# EAGLE design MB-Peripheral-1 (EAGLE 5.10)
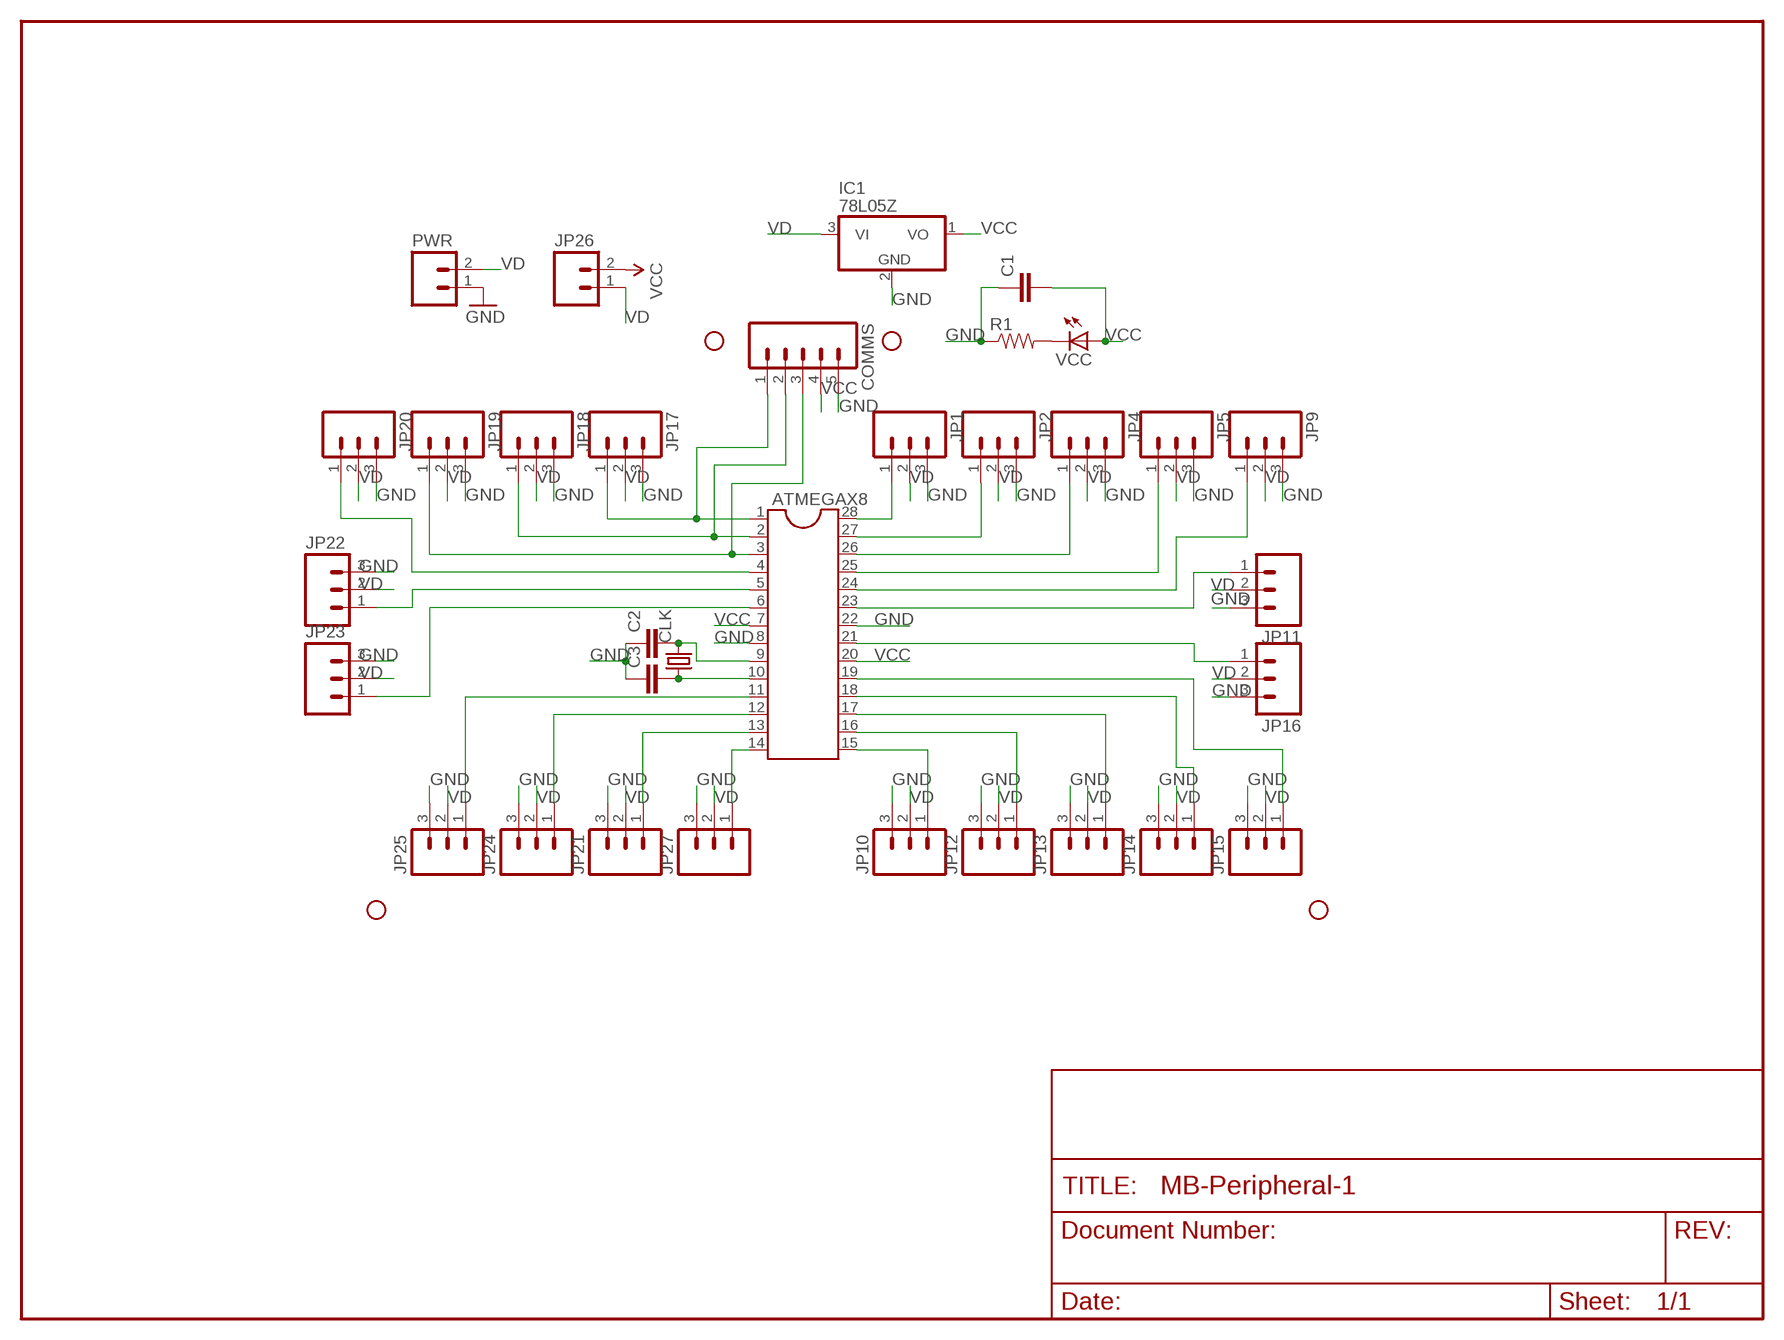
[diagram p0: schematic, sheet 1]

## Parts
ATMEGAX8  DIL28-3  [DIL28-3]
C1  CAPPTH1  [CAP-PTH-5MM]
C2  CAPPTH  [CAP-PTH-SMALL]
C3  CAPPTH  [CAP-PTH-SMALL]
CLK  CRYSTALHC49S  [HC49/S]
COMMS  M05LOCK  [1X05_LOCK]
IC1  78L05Z  [TO92]
JP1  M03LOCK  [1X03_LOCK]
JP2  M03LOCK  [1X03_LOCK]
JP3  STAND-OFF  [STAND-OFF]
JP4  M03LOCK  [1X03_LOCK]
JP5  M03LOCK  [1X03_LOCK]
JP7  STAND-OFF  [STAND-OFF]
JP9  M03LOCK  [1X03_LOCK]
JP10  M03LOCK  [1X03_LOCK]
JP11  M03LOCK  [1X03_LOCK]
JP12  M03LOCK  [1X03_LOCK]
JP13  M03LOCK  [1X03_LOCK]
JP14  M03LOCK  [1X03_LOCK]
JP15  M03LOCK  [1X03_LOCK]
JP16  M03LOCK  [1X03_LOCK]
JP17  M03LOCK  [1X03_LOCK]
JP18  M03LOCK  [1X03_LOCK]
JP19  M03LOCK  [1X03_LOCK]
JP20  M03LOCK  [1X03_LOCK]
JP21  M03LOCK  [1X03_LOCK]
JP22  M03LOCK  [1X03_LOCK]
JP23  M03LOCK  [1X03_LOCK]
JP24  M03LOCK  [1X03_LOCK]
JP25  M03LOCK  [1X03_LOCK]
JP26  M02LOCK  [1X02_LOCK]
JP27  M03LOCK  [1X03_LOCK]
JP29  STAND-OFF  [STAND-OFF]
JP30  STAND-OFF  [STAND-OFF]
PWR  M023.5MM_LOCK  [SCREWTERMINAL-3.5MM-2_LOCK]
R1  RESISTORPTH1  [AXIAL-0.3]
VCC  LED3MM  [LED3MM]

## Nets
GND: ATMEGAX8.8 ATMEGAX8.22 C1.1 C2.1 C3.1 COMMS.5 IC1.2(GND) JP1.3 JP2.3 JP4.3 JP5.3 JP9.3 JP10.3 JP11.3 JP12.3 JP13.3 JP14.3 JP15.3 JP16.3 JP17.3 JP18.3 JP19.3 JP20.3 JP21.3 JP22.3 JP23.3 JP24.3 JP25.3 JP27.3 PWR.1 R1.P$1
N$1: ATMEGAX8.9 C2.2 CLK.2
N$2: ATMEGAX8.5 JP22.1
N$3: ATMEGAX8.16 JP12.1
N$4: ATMEGAX8.15 JP10.1
N$5: ATMEGAX8.21 JP16.1
N$6: ATMEGAX8.19 JP15.1
N$7: R1.P$2 VCC.K(C)
N$8: ATMEGAX8.17 JP13.1
N$9: ATMEGAX8.23 JP11.1
N$10: ATMEGAX8.24 JP9.1
N$11: ATMEGAX8.25 JP5.1
N$12: ATMEGAX8.26 JP4.1
N$14: ATMEGAX8.14 JP27.1
N$16: ATMEGAX8.10 C3.2 CLK.1
N$17: ATMEGAX8.27 JP2.1
N$18: ATMEGAX8.28 JP1.1
N$19: ATMEGAX8.4 JP20.1
N$20: ATMEGAX8.13 JP21.1
N$21: ATMEGAX8.12 JP24.1
N$25: ATMEGAX8.6 JP23.1
N$26: ATMEGAX8.11 JP25.1
N$35: ATMEGAX8.18 JP14.1
RST: ATMEGAX8.1 COMMS.1 JP17.1
RXD: ATMEGAX8.2 COMMS.2 JP18.1
TXD: ATMEGAX8.3 COMMS.3 JP19.1
VCC: ATMEGAX8.7 ATMEGAX8.20 C1.2 COMMS.4 IC1.1(VO) JP26.2 VCC.A
VD: IC1.3(VI) JP1.2 JP2.2 JP4.2 JP5.2 JP9.2 JP10.2 JP11.2 JP12.2 JP13.2 JP14.2 JP15.2 JP16.2 JP17.2 JP18.2 JP19.2 JP20.2 JP21.2 JP22.2 JP23.2 JP24.2 JP25.2 JP26.1 JP27.2 PWR.2

## Library data of the parts
ATMEGAX8 = ic-package:DIL28: Dual In Line
C1-C3 = SparkFun:CAP: Capacitor Standard 0603 ceramic capacitor, and 0.1" leaded capacitor.
CLK = crystal:CRYSTAL: CRYSTAL
COMMS = SparkFun:M05: Header 5 Standard 5-pin 0.1" header. Use with straight break away headers (SKU : PRT-00116), right angle break away headers (PRT-00553), swiss pins (PRT-00743), machine pins (PRT-00117), and female headers (PRT-00115). Molex polarized connector foot print use with SKU : PRT-08230 with associated crimp pins and housings.
IC1 = linear:78*: Positive VOLTAGE REGULATOR Source: http://cache.national.com/ds/LM/LM78L05.pdf http://www.fairchildsemi.com/ds/LM/LM7805.pdf
JP1 JP2 JP4 JP5 JP9-JP25 JP27 = SparkFun:M03: Header 3 Standard 3-pin 0.1" header. Use with straight break away headers (SKU : PRT-00116), right angle break away headers (PRT-00553), swiss pins (PRT-00743), machine pins (PRT-00117), and female headers (PRT-00115). Molex polarized connector foot print use with SKU : PRT-08232 with associated crimp pins and housings.
JP3 JP7 JP29 JP30 = SparkFun:STAND-OFF: Stand Off This is the mechanical footprint for a #4 phillips button head screw. Use the keepout ring to avoid running the screw head into surrounding components. SKU : PRT-00447
JP26 PWR = SparkFun:M02: Header 2 Standard 2-pin 0.1" header. Use with straight break away headers (SKU : PRT-00116), right angle break away headers (PRT-00553), swiss pins (PRT-00743), machine pins (PRT-00117), and female headers (PRT-00115). Molex polarized connector foot print use with SKU : PRT-08233 with associated crimp pins and housings.
R1 = SparkFun:RESISTOR: Resistor Basic schematic elements and footprints for 0603, 1206, and PTH 1/10th watt (small) resistors.
VCC = SparkFun:LED: LEDs Standard schematic elements and footprints for 5mm, 3mm, 1206, and 0603 sized LEDs. 5mm - Spark Fun Electronics SKU : COM-00529 (and others)

## Board
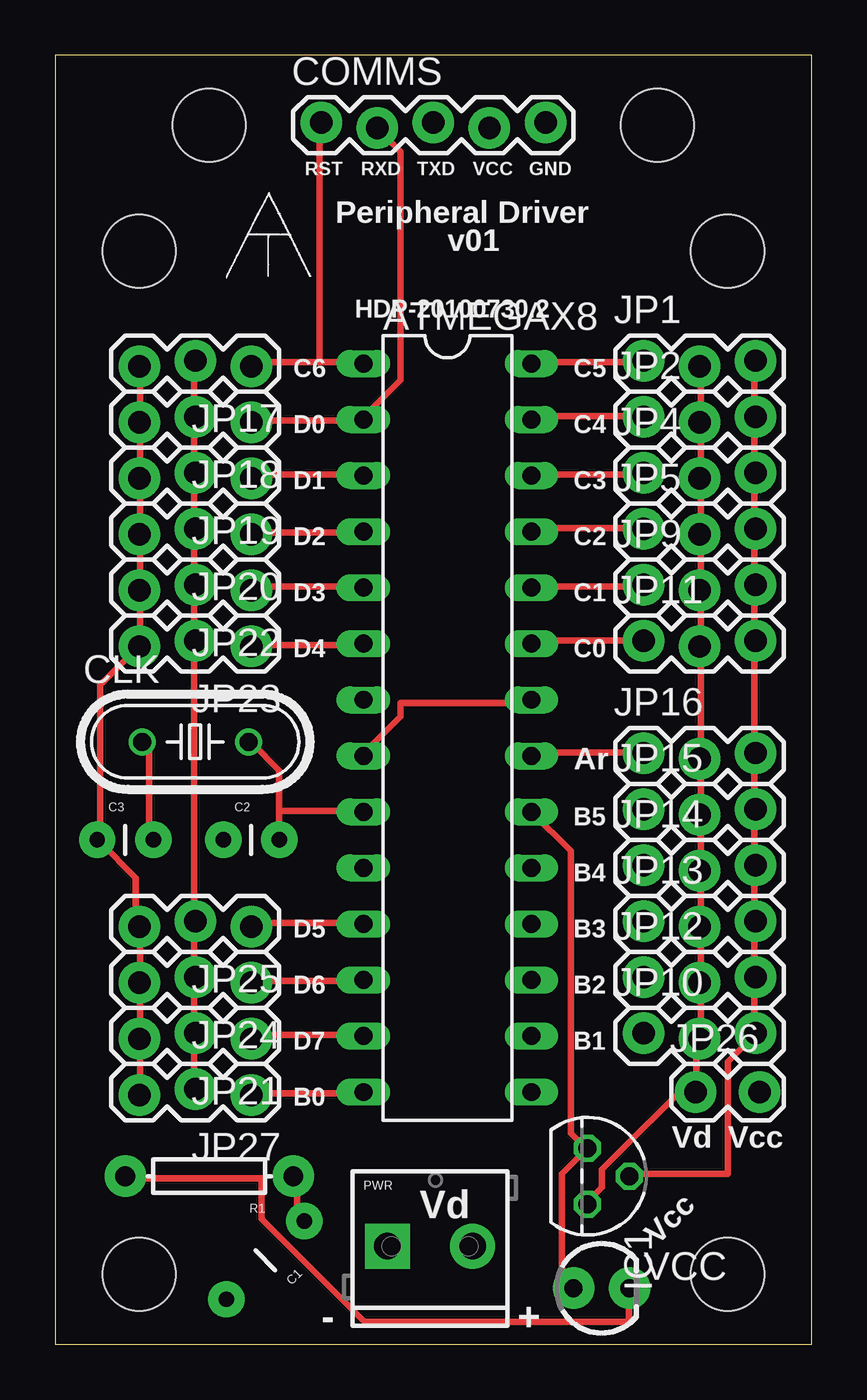
[diagram p1: board, top side]
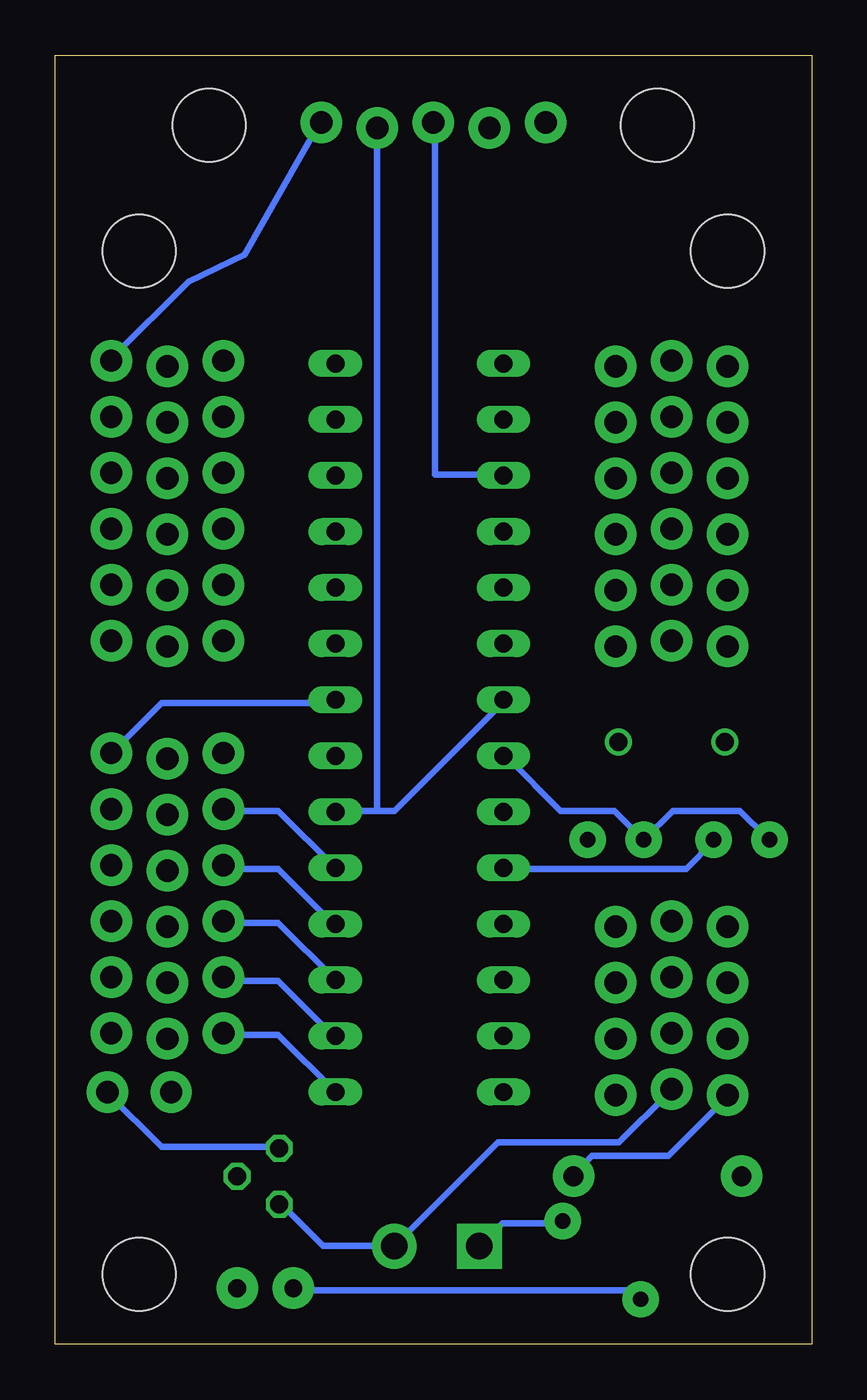
[diagram p2: board, bottom side, seen from below]

Size 34.29 x 58.42 mm. Coordinates in mm from the lower left corner, seen from the top.
Outline: 0,0 34.29,0 34.29,58.42 0,58.42 0,0
Copper layers (1*16): Top 0.0356mm / dielectric 1.5011mm / Bottom 0.0356mm
Design rules "LaenPCBOrder *": minimum track width 12mil, minimum drill 13mil, track to track 12mil, track to pad 12mil, pad to pad 12mil, via to via 12mil, smd to smd 6mil, copper to edge 15mil, drill to drill 6mil, minimum pad ring 7mil, minimum via ring 7mil, stop-mask expansion 4mil, vias tented up to drill 0mil, thermal gap 10mil

### Footprints (pad centres in the part's own frame; a part is rotated, then mirrored left to right if it is on the bottom)
DIL28-3 = drill 0.813 long: 1 -16.51,-3.81; 2 -13.97,-3.81; 3 -11.43,-3.81; 4 -8.89,-3.81; 5 -6.35,-3.81; 6 -3.81,-3.81; 7 -1.27,-3.81; 8 1.27,-3.81; 9 3.81,-3.81; 10 6.35,-3.81; 11 8.89,-3.81; 12 11.43,-3.81; 13 13.97,-3.81; 14 16.51,-3.81; 15 16.51,3.81; 16 13.97,3.81; 17 11.43,3.81; 18 8.89,3.81; 19 6.35,3.81; 20 3.81,3.81; 21 1.27,3.81; 22 -1.27,3.81; 23 -3.81,3.81; 24 -6.35,3.81; 25 -8.89,3.81; 26 -11.43,3.81; 27 -13.97,3.81; 28 -16.51,3.81
CAP-PTH-5MM = drill 0.7 pad 1.651 round: 1 -2.5,0; 2 2.5,0
CAP-PTH-SMALL = drill 0.7 pad 1.651 round: 1 0,0; 2 2.54,0
HC49/S = drill 0.813 round: 1 -2.413,0; 2 2.413,0
1X05_LOCK = drill 1.016 pad 1.88 round: 1 0,0.127; 2 2.54,-0.127; 3 5.08,0.127; 4 7.62,-0.127; 5 10.16,0.127
TO92 = drill 0.813 octagon: 1 -1.27,0; 2 0,1.905; 3 1.27,0
1X03_LOCK = drill 1.016 pad 1.88 round: 1 0,0.127; 2 2.54,-0.127; 3 5.08,0.127
STAND-OFF = hole 3.302: 0,0
1X02_LOCK = drill 1.016 pad 1.88 round: 1 -0.178,0; 2 2.718,0
SCREWTERMINAL-3.5MM-2_LOCK = drill 1.2 pad 2.032 square: 1 -0.178,0 | drill 1.2 pad 2.032 round: 2 3.678,0
AXIAL-0.3 = drill 0.9 pad 1.88 round: P$1 -3.81,0; P$2 3.81,0
LED3MM = drill 0.813 pad 1.88 round: A -1.27,0; K 1.27,0

### Placement (x,y rotation side)
ATMEGAX8  17.78,27.94 270 top
C1  9.53,3.81 225 top
C2  7.62,22.86 0 top
C3  1.91,22.86 0 top
CLK  6.35,27.3 0 top
COMMS  12.06,55.24 0 top
IC1  24.13,7.62 270 top
JP1  26.67,44.45 0 top
JP2  26.67,41.91 0 top
JP3  3.81,49.53 0 top
JP4  26.67,39.37 0 top
JP5  26.67,36.83 0 top
JP6  STAND-OFF  [STAND-OFF]  3.81,3.17 0 top
JP7  30.48,3.17 0 top
JP8  STAND-OFF  [STAND-OFF]  30.48,49.53 0 top
JP9  26.67,34.29 0 top
JP10  26.67,13.97 0 top
JP11  26.67,31.75 0 top
JP12  26.67,16.51 0 top
JP13  26.67,19.05 0 top
JP14  26.67,21.59 0 top
JP15  26.67,24.13 0 top
JP16  26.67,26.67 0 top
JP17  8.89,44.45 180 top
JP18  8.89,41.91 180 top
JP19  8.89,39.37 180 top
JP20  8.89,36.83 180 top
JP21  8.89,13.97 180 top
JP22  8.89,34.29 180 top
JP23  8.89,31.75 180 top
JP24  8.89,16.51 180 top
JP25  8.89,19.05 180 top
JP26  29.21,11.43 0 top
JP27  8.89,11.43 180 top
JP29  27.3,55.24 0 top
JP30  6.99,55.24 0 top
PWR  15.24,4.45 0 top
R1  6.99,7.62 180 top
VCC  24.77,2.54 0 top

### Tracks (layer width: path | path; a pad name or v marks a point on that pad's centre or on a via)
GND
  Top 0.305: IC1.2 26.21,7.72 30.48,7.72 30.48,12.8 31.7,14.02 JP10.3 31.7,14.22 31.7,16.46 JP12.3 31.7,16.66 31.7,19.1 JP13.3 31.7,19.3 31.7,21.54 JP14.3 31.7,21.74 31.7,24.18 JP15.3 31.7,24.38 31.7,26.62 JP16.3 31.7,26.82 31.7,31.7 JP11.3 31.7,31.9 31.7,34.34 JP9.3 31.7,34.54 31.7,36.78 JP5.3 31.7,36.98 31.7,39.42 JP4.3 31.7,39.62 31.7,41.86 JP2.3 31.7,42.06 31.7,44.5 JP1.3 | ATMEGAX8.22 21.54,29.06 15.65,29.06 15.65,28.45 14.02,26.82 ATMEGAX8.8 | JP17.3 3.86,44.3 3.86,41.86 JP18.3 3.86,41.66 3.86,39.42 JP19.3 3.86,39.22 3.86,36.78 JP20.3 3.86,36.58 3.86,34.34 JP22.3 3.86,34.14 3.86,31.7 JP23.3 3.66,31.5 2.03,29.87 2.03,22.96 C3.1 2.03,22.76 3.66,21.13 3.66,19.1 JP25.3 3.86,18.9 3.86,16.46 JP24.3 3.86,16.26 3.86,14.02 JP21.3 3.86,13.82 3.86,11.38 JP27.3 | C1.1 11.18,5.69 10.97,5.89 10.97,7.52 R1.P$1
  Bottom 0.305: COMMS.5 22.35,55.27 25.7,49.38 28.25,48.16 31.7,44.7 JP1.3 | ATMEGAX8.8 13.82,26.62 11.38,24.18 8.94,24.18 C2.1 6.3,24.18 3.25,24.18 2.03,22.96 C3.1 | PWR.1 14.02,5.49 11.38,5.49 C1.1 | R1.P$1 10.77,7.72 9.96,8.53 6.5,8.53 3.86,11.18 JP27.3 | JP16.3 31.7,26.82 29.46,29.06 21.74,29.06 ATMEGAX8.22
N$1
  Top 0.305: 10.16,24.18 10.16,26.01 8.94,27.23 CLK.2 | C2.2 10.16,24.18 | 10.16,24.18 13.82,24.18 ATMEGAX8.9
N$2
  Top 0.305: ATMEGAX8.5 13.82,34.34 8.94,34.34 JP22.1
N$3
  Bottom 0.305: ATMEGAX8.16 21.74,14.02 24.18,16.46 26.62,16.46 JP12.1
N$4
  Bottom 0.305: ATMEGAX8.15 24.18,14.02 26.62,14.02 JP10.1
N$5
  Top 0.305: ATMEGAX8.21 21.74,26.82 26.62,26.82 JP16.1
N$6
  Bottom 0.305: ATMEGAX8.19 24.18,24.18 26.62,24.18 JP15.1
N$7
  Top 0.305: R1.P$2 3.25,7.52 9.35,7.52 9.35,5.69 14.02,1.02 26.01,1.02 26.01,2.44 VCC.K
N$8
  Bottom 0.305: ATMEGAX8.17 24.18,19.1 26.62,19.1 JP13.1
N$9
  Top 0.305: ATMEGAX8.23 21.74,31.9 26.62,31.9 JP11.1
N$10
  Top 0.305: ATMEGAX8.24 21.74,34.34 26.62,34.34 JP9.1
N$11
  Top 0.305: ATMEGAX8.25 21.74,36.98 26.62,36.98 JP5.1
N$12
  Top 0.305: ATMEGAX8.26 21.74,39.42 26.62,39.42 JP4.1
N$14
  Top 0.305: ATMEGAX8.14 13.82,11.38 8.94,11.38 JP27.1
N$16
  Top 0.305: CLK.1 4.06,27.23 4.27,27.03 4.27,22.96 C3.2
  Bottom 0.305: ATMEGAX8.10 13.82,21.54 5.69,21.54 4.47,22.76 C3.2
N$17
  Top 0.305: ATMEGAX8.27 21.74,42.06 26.62,42.06 JP2.1
N$18
  Top 0.305: ATMEGAX8.28 21.74,44.5 26.62,44.5 JP1.1
N$19
  Top 0.305: ATMEGAX8.4 13.82,36.78 8.94,36.78 JP20.1
N$20
  Top 0.305: ATMEGAX8.13 13.82,14.02 8.94,14.02 JP21.1
N$21
  Top 0.305: ATMEGAX8.12 13.82,16.46 8.94,16.46 JP24.1
N$25
  Top 0.305: ATMEGAX8.6 13.82,31.7 8.94,31.7 JP23.1
N$26
  Top 0.305: ATMEGAX8.11 13.82,19.1 8.94,19.1 JP25.1
N$35
  Bottom 0.305: ATMEGAX8.18 21.74,19.1 24.18,21.54 26.62,21.54 JP14.1
RST
  Top 0.305: 11.99,44.5 8.94,44.5 JP17.1 | 11.99,44.5 13.82,44.5 ATMEGAX8.1 | 11.99,44.5 11.99,55.27 COMMS.1
RXD
  Top 0.305: JP18.1 8.94,41.86 13.82,41.86 ATMEGAX8.2 14.02,42.06 15.65,43.69 15.65,54.05 14.63,55.07 COMMS.2
TXD
  Top 0.305: ATMEGAX8.3 13.82,39.42 8.94,39.42 JP19.1
  Bottom 0.305: COMMS.3 17.07,55.27 17.07,39.42 14.02,39.42 ATMEGAX8.3
VCC
  Top 0.305: VCC.A 23.37,2.64 22.96,3.05 22.96,7.72 IC1.1 23.98,8.94 23.37,9.55 23.37,22.35 ATMEGAX8.20
  Bottom 0.305: C1.2 7.92,2.23 8.13,2.44 23.37,2.44 VCC.A | JP26.2 31.9,11.38 29.46,8.94 24.18,8.94 IC1.1 | 19.71,24.18 21.54,24.18 ATMEGAX8.20 | 19.71,24.18 18.9,24.18 14.02,29.06 ATMEGAX8.7 | 19.71,24.18 19.71,55.07 COMMS.4
VD
  Top 0.305: JP27.2 6.3,11.58 6.3,14.02 JP21.2 6.3,14.22 6.3,16.46 JP24.2 6.3,16.66 6.3,19.1 JP25.2 6.3,19.3 6.3,31.7 JP23.2 6.3,31.9 6.3,34.34 JP22.2 6.3,34.54 6.3,36.78 JP20.2 6.3,36.98 6.3,39.42 JP19.2 6.3,39.62 6.3,41.86 JP18.2 6.3,42.06 6.3,44.5 JP17.2 | JP1.2 29.26,44.3 29.26,41.86 JP2.2 29.26,41.66 29.26,39.42 JP4.2 29.26,39.22 29.26,36.78 JP5.2 29.26,36.58 29.26,34.34 JP9.2 29.26,34.14 29.26,31.7 JP11.2 29.26,31.5 29.26,26.62 JP16.2 29.26,26.42 29.26,24.18 JP15.2 29.26,23.98 29.26,21.54 JP14.2 29.26,21.34 29.26,19.1 JP13.2 29.26,18.9 29.26,16.46 JP12.2 29.26,16.26 29.26,14.02 JP10.2 29.06,13.82 29.06,12.19 | 29.06,12.19 29.06,11.58 JP26.1 29.06,12.19 | 29.06,12.19 24.79,7.92 24.79,7.11 24.18,6.5 IC1.3
  Bottom 0.305: IC1.3 23.98,6.3 22.15,4.47 19.1,4.47 PWR.2 18.9,4.47 14.22,9.14 8.74,9.14 6.5,11.38 JP27.2

### Text on the board
tPlace: RST | RXD | TXD | VCC | GND | Peripheral Driver | v01 | HDP-20100730.2 | C6 | C5 | D0 | C4 | D1 | C3 | D2 | C2 | D3 | C1 | D4 | C0 | Ar | B5 | B4 | D5 | B3 | D6 | B2 | D7 | B1 | B0 | Vd | Vcc | Vd | Vcc | - | +